# Altium schematic sheet BattVoltSense.SchDoc
size B; SheetNumber: 9; SheetTotal: 15
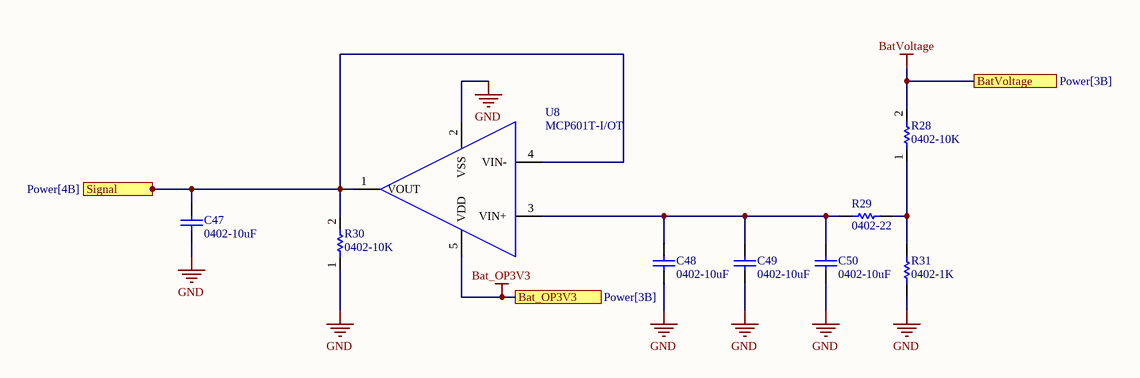
[diagram p0: BattVoltSense.SchDoc]

## Parts
C47  0402-10uF  [CAPC0402(1005)60_N]
C48  0402-10uF  [CAPC0402(1005)60_N]
C49  0402-10uF  [CAPC0402(1005)60_N]
C50  0402-10uF  [CAPC0402(1005)60_N]
R28  0402-10K  [R-0402-10K]
R29  0402-22  [R-0402-1K]
R30  0402-10K  [R-0402-10K]
R31  0402-1K  [R-0402-1K]
U8  MCP601T-I/OT  [SOT95P280X145-5N]

## Ports
Bat_OP3V3 (see Power[3B]), BatVoltage (see Power[3B]), Signal (see Power[4B])

## Nets
Bat_OP3V3: U8.5(VDD) ; port Bat_OP3V3
BatVoltage: R28.2 ; port BatVoltage
GND: C47.1 C48.1 C49.1 C50.1 R30.1 R31.1 U8.2(VSS)
Signal: C47.2 R30.2 U8.1(VOUT) U8.4(VIN-) ; port Signal
NetC48_2: C48.2 C49.2 C50.2 R29.1 U8.3(VIN+)
NetR28_1: R28.1 R29.2 R31.2

## Library data of the parts
C47-C50 = CMP-001-00352-3: Capacitor 10uF 0402s; Tolerance: 20%; Value: 10µF; Dielectric: X5R; Voltage Rating (DC): 4V; Width: 0.02inch; Packaging: Tape and Reel; RoHS Compliant: Yes; Series: M; Mount: Surface Mount; Termination: SMD/SMT; Source: 0402-10uF.SchLib; Design Item ID: CMP-1034-02139-2; Min Operating Temperature: -55°C; Construction: Flat; Component Type: Standard; Case Code (Metric): 1005; Length: 0.039inch; Height: 0.5mm; Pins: 2; Thickness: 0.028inch; Voltage Rating: 4V; Package Quantity: 1; Max Operating Temperature: 85°C; Halogen Free: Halogen Free; Case/Package: 0402
R28 R30 = CMP-009-00675-4: RES 0402 10K; Value: 10k
R29 = CMP-009-00695-1: 0402Resistor 22Ohm; Value: 22
R31 = CMP-009-00674-3: 0402Resistor 1K Ohm; Value: 1k
U8 = CMP-014-00080-5: General Purpose Amplifier 1 Circuit Rail-to-Rail SOT-23-5; MF: Microchip; Price: None; Design Item ID: MCP601T-I/OT; Pins: 5; Case/Package: SOT-23 Microchip; Component Type: Standard; SnapEDA_Link: https://www.snapeda.com/parts/MCP601T-I/OT/Microchip/view-part/43729/?ref=snap; Value: *; Source: SnapEDAsch.SchLib; MP: MCP601T-I/OT; Availability: Unavailable